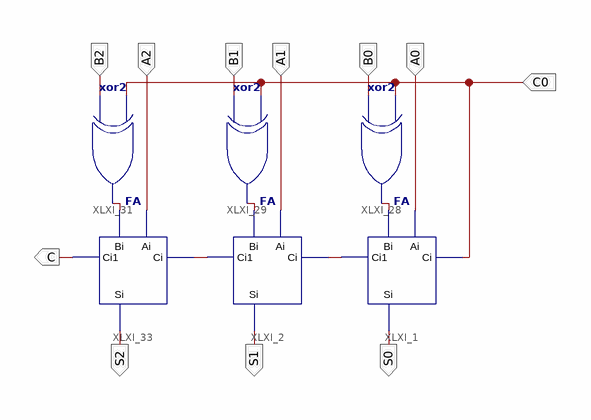
[diagram p0: schematic sheet 1]
// Xilinx ISE schematic FA3.sch (spartan3e) as structural Verilog: 6 symbols, 11 ports
module FA3 (
  input  B0,
  input  A0,
  input  B1,
  input  A1,
  input  B2,
  input  A2,
  input  C0,
  output C,
  output S0,
  output S1,
  output S2
);

  wire XLXN_1, XLXN_2, XLXN_22, XLXN_38, XLXN_45;

  FA XLXI_1 (.Ai(A0), .Bi(XLXN_22), .Ci(C0), .Ci1(XLXN_1), .Si(S0));
  FA XLXI_2 (.Ai(A1), .Bi(XLXN_38), .Ci(XLXN_1), .Ci1(XLXN_2), .Si(S1));
  xor XLXI_28 (XLXN_22, B0, C0);
  xor XLXI_29 (XLXN_38, B1, C0);
  xor XLXI_31 (XLXN_45, B2, C0);
  FA XLXI_33 (.Ai(A2), .Bi(XLXN_45), .Ci(XLXN_2), .Ci1(C), .Si(S2));
endmodule
